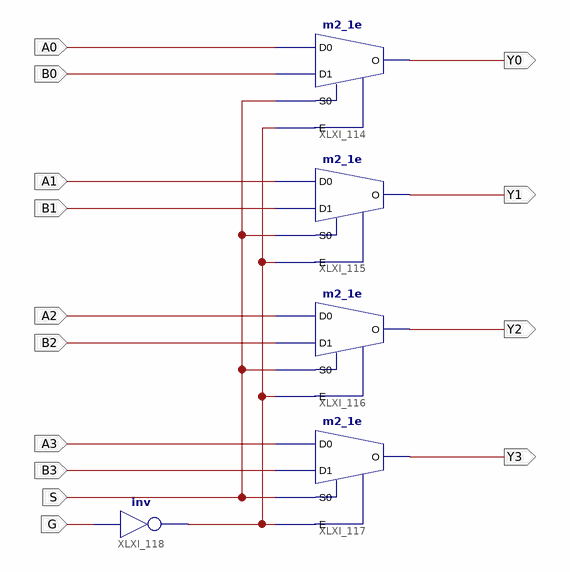
[diagram p0: schematic sheet 1]
// Xilinx ISE schematic X74_157.sch (spartan3e) as structural Verilog: 5 symbols, 14 ports
module X74_157 (
  input  B3,
  input  A3,
  input  A2,
  input  B2,
  input  A1,
  input  B1,
  input  A0,
  input  B0,
  input  S,
  input  G,
  output Y0,
  output Y1,
  output Y2,
  output Y3
);

  wire XLXN_196;

  m2_1e XLXI_114 (.D0(A0), .D1(B0), .E(XLXN_196), .S0(S), .O(Y0));
  m2_1e XLXI_115 (.D0(A1), .D1(B1), .E(XLXN_196), .S0(S), .O(Y1));
  m2_1e XLXI_116 (.D0(A2), .D1(B2), .E(XLXN_196), .S0(S), .O(Y2));
  m2_1e XLXI_117 (.D0(A3), .D1(B3), .E(XLXN_196), .S0(S), .O(Y3));
  not XLXI_118 (XLXN_196, G);
endmodule
